# EAGLE design AD7689 (EAGLE 7.1.0)
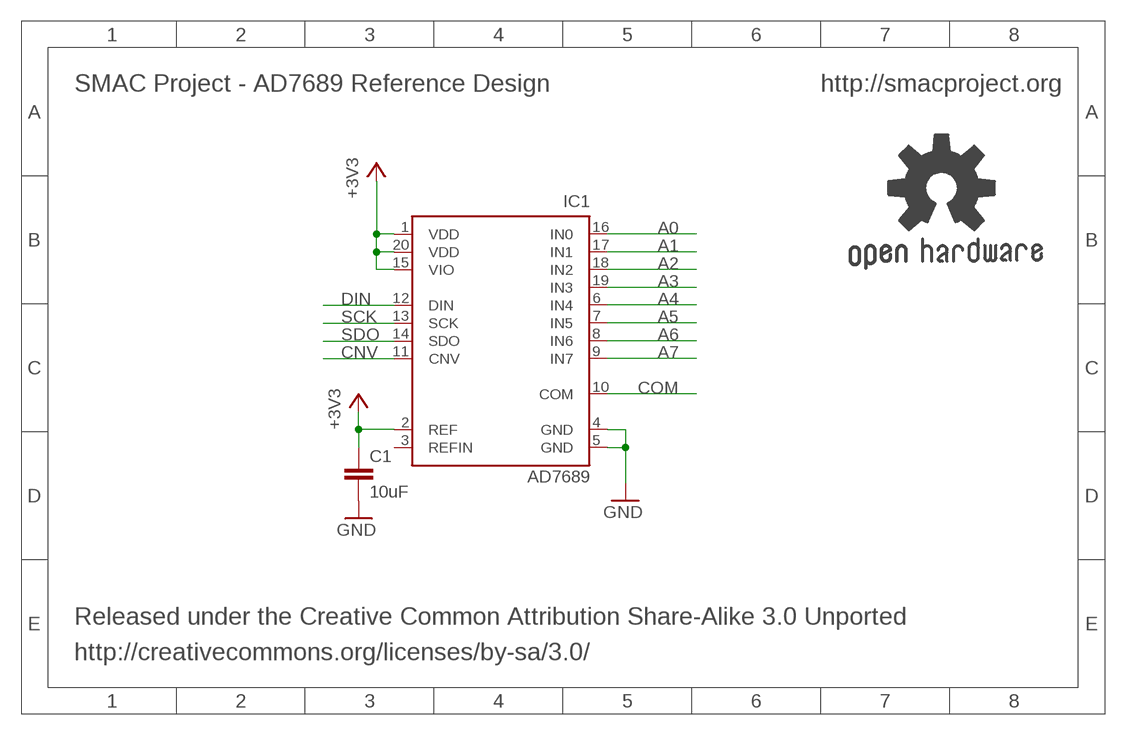
[diagram p0: schematic, sheet 1]

## Parts
C1  10uF  C-EUC0402  [C0402]
GOLD_ORB_SM1  OSHWLOGO_REF_SM  [OSHW2REF]
IC1  AD7689  [LFCSP20]

## Nets
+3V3: C1.1 IC1.1(VDD) IC1.2(REF) IC1.15(VIO) IC1.20(VDD)
A0: IC1.16(IN0)
A1: IC1.17(IN1)
A2: IC1.18(IN2)
A3: IC1.19(IN3)
A4: IC1.6(IN4)
A5: IC1.7(IN5)
A6: IC1.8(IN6)
A7: IC1.9(IN7)
CNV: IC1.11(CNV)
COM: IC1.10(COM)
DIN: IC1.12(DIN)
GND: C1.2 IC1.4(GND) IC1.5(GND)
SCK: IC1.13(SCK)
SDO: IC1.14(SDO)
Unconnected: IC1.3(REFIN)

## Notes on the sheet
- SMAC Project - AD7689 Reference Design | http://smacproject.org
- Released under the Creative Common Attribution Share-Alike 3.0 Unported
- http://creativecommons.org/licenses/by-sa/3.0/

## Library data of the parts
C1 = resistor:C-EU: CAPACITOR, European symbol
GOLD_ORB_SM1 = bfl:OSHWLOGO: These are Open-Source Hardware logos.
IC1 = analog-devices:AD7689

## Board
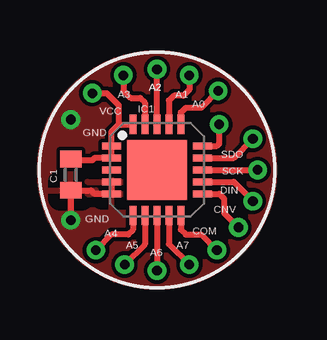
[diagram p1: board, top side]
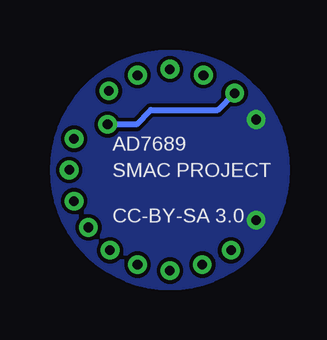
[diagram p2: board, bottom side, seen from below]

No outline drawn. Coordinates in mm, seen from the top.
Copper layers (1*16): Top 0.035mm / dielectric 1.5mm / Bottom 0.035mm
Design rules "2_layer_standard_4pcb": minimum track width 5mil, minimum drill 15mil, track to track 6mil, track to pad 6mil, pad to pad 6mil, via to via 6mil, smd to smd 0mil, copper to edge 6mil, drill to drill 6mil, minimum pad ring 7.5mil, minimum via ring 7.5mil, stop-mask expansion 4mil, vias tented up to drill 15mil, thermal gap 20mil

### Footprints (pad centres in the part's own frame; a part is rotated, then mirrored left to right if it is on the bottom)
C0402 = smd 0.7 x 0.9: 1 -0.65,0; 2 0.65,0
LFCSP20 = smd 0.8 x 0.3: 1 -1.9,1; 2 -1.9,0.5; 3 -1.9,0; 4 -1.9,-0.5; 5 -1.9,-1; 11 1.9,-1; 12 1.9,-0.5; 13 1.9,0; 14 1.9,0.5; 15 1.9,1 | smd 0.3 x 0.8: 6 -1,-1.9; 7 -0.5,-1.9; 8 0,-1.9; 9 0.5,-1.9; 10 1,-1.9; 16 1,1.9; 17 0.5,1.9; 18 0,1.9; 19 -0.5,1.9; 20 -1,1.9 | smd 2.5 x 2.5: 21 0,0

### Placement (x,y rotation side)
C1  2.3,5.6 270 top
GOLD_ORB_SM1  12.6,2.5 0 top
IC1  5.9,5.8 0 top

### Tracks (layer width: path | path; a pad name or v marks a point on that pad's centre or on a via)
+3V3  (via drill 0.4 pad 0.25)
  Top 0.254: 4.3,7.7 4,7.4 IC1.1 IC1.2 3.3,6.3 3.2,6.2 2.35,6.2 C1.1 | 4.3,7.7 IC1.20 | IC1.15 8.4,6.8 8.5,6.9 v8.5,7.7 | v3.2,9 3.8,9 4.3,8.5 4.3,7.7
  Bottom 0.254: v8.5,7.7 7.3,7.7 6.7,8.3 3.9,8.3 v3.2,9
A0  (via drill 0.4 pad 0.25)
  Top 0.254: IC1.16 6.9,8.2 7.1,8.4 7.75,8.4 v8.45,9.1
A1  (via drill 0.4 pad 0.25)
  Top 0.254: v7.25,9.75 7.25,9.15 7,8.9 6.6,8.9 6.4,8.7 IC1.17
A2  (via drill 0.4 pad 0.25)
  Top 0.254: IC1.18 v5.9,10
A3  (via drill 0.4 pad 0.25)
  Top 0.254: v4.5,9.75 4.5,9.1 4.8,8.8 5.2,8.8 5.4,8.6 IC1.19
A4  (via drill 0.4 pad 0.25)
  Top 0.254: IC1.6 4.9,3.3 4.7,3.1 4,3.1 v3.35,2.45
A5  (via drill 0.4 pad 0.25)
  Top 0.254: IC1.7 5.4,2.7 v4.55,1.85
A6  (via drill 0.4 pad 0.25)
  Top 0.254: IC1.8 v5.9,1.6
A7  (via drill 0.4 pad 0.25)
  Top 0.254: IC1.9 6.4,2.7 v7.25,1.85
CNV  (via drill 0.4 pad 0.25)
  Top 0.254: IC1.11 8.5,4.8 8.7,4.6 8.7,4 v9.3,3.4
COM  (via drill 0.4 pad 0.25)
  Top 0.254: IC1.10 6.9,3.3 7.1,3.1 7.75,3.1 v8.4,2.45
DIN  (via drill 0.4 pad 0.25)
  Top 0.254: IC1.12 9.1,5.3 v9.9,4.5
GND  (via drill 0.4 pad 0.25)
  Top 0.254: IC1.4 IC1.5 3.3,4.8 3.15,4.95 C1.2 v2.3,3.7
  other vias: 2.3,7.9
  pour Bottom: 1,5.8 arc-90 5.9,10.7 arc-90 10.8,5.8 arc-90 5.9,0.9 arc-90
  pour Top: 1,5.8 arc-90 5.9,10.7 arc-90 10.8,5.8 arc-90 5.9,0.9 arc-90
SCK  (via drill 0.4 pad 0.25)
  Top 0.254: IC1.13 v10.1,5.8
SDO  (via drill 0.4 pad 0.25)
  Top 0.254: IC1.14 9.1,6.3 v9.9,7.1

### Text on the board
tPlace: A3 | A2 | A2 | A1 | A0 | VCC | GND | SDO | SCK | DIN | GND | CNV | A4 | COM | A5 | A6 | A7
bPlace: AD7689 | SMAC PROJECT | CC-BY-SA 3.0
Reference: http://smacproject.org